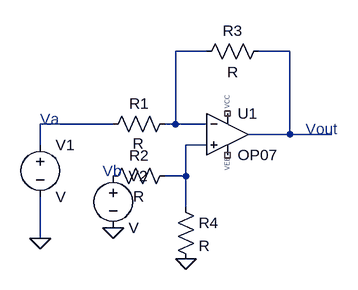
[diagram p0: schematic Draft2.asc]
Draft2.asc, the LTspice schematic file:
Version 4
SHEET 1 880 680
WIRE 192 32 144 32
WIRE 320 32 272 32
WIRE 48 144 -64 144
WIRE 144 144 144 32
WIRE 144 144 128 144
WIRE 192 144 144 144
WIRE 320 160 320 32
WIRE 320 160 256 160
WIRE 384 160 320 160
WIRE -64 176 -64 144
WIRE 192 176 160 176
WIRE 160 224 160 176
WIRE 160 224 128 224
WIRE 160 272 160 224
WIRE -64 320 -64 256
FLAG -64 320 0
FLAG 48 304 0
FLAG 160 352 0
SYMBOL OpAmps\\OP07 224 96 R0
SYMATTR InstName U1
SYMBOL res 144 128 R90
WINDOW 0 0 56 VBottom 2
WINDOW 3 30 57 VTop 2
SYMATTR InstName R1
SYMBOL res 144 208 R90
WINDOW 0 0 56 VBottom 2
WINDOW 3 32 56 VTop 2
SYMATTR InstName R2
SYMBOL voltage -64 160 R0
SYMATTR InstName V1
SYMBOL voltage 48 208 R0
SYMATTR InstName V2
SYMBOL res 288 16 R90
WINDOW 0 0 56 VBottom 2
WINDOW 3 32 56 VTop 2
SYMATTR InstName R3
SYMBOL res 144 256 R0
SYMATTR InstName R4
TEXT 224 120 VLeft 0 ;VCC
TEXT 224 216 VLeft 0 ;VEE
TEXT -64 136 Left 2 ;Va
TEXT 32 216 Left 2 ;Vb
TEXT 344 152 Left 2 ;Vout

The netlist it stands for:
* Draft2.asc
XU1 N004 N001 NC_01 NC_02 N002 LT1001  ; OP07, pins In+ In- V+ V- OUT
R1 N001 N003 R
R2 N004 P001 R
V1 N003 0 V
V2 P001 0 V
R3 N002 N001 R
R4 N004 0 R
* VCC
* VEE
* Va
* Vb
* Vout
.lib LTC.lib
.backanno
.end